# Altium schematic sheet bh_carrier_0_beta.SchDoc
size A2
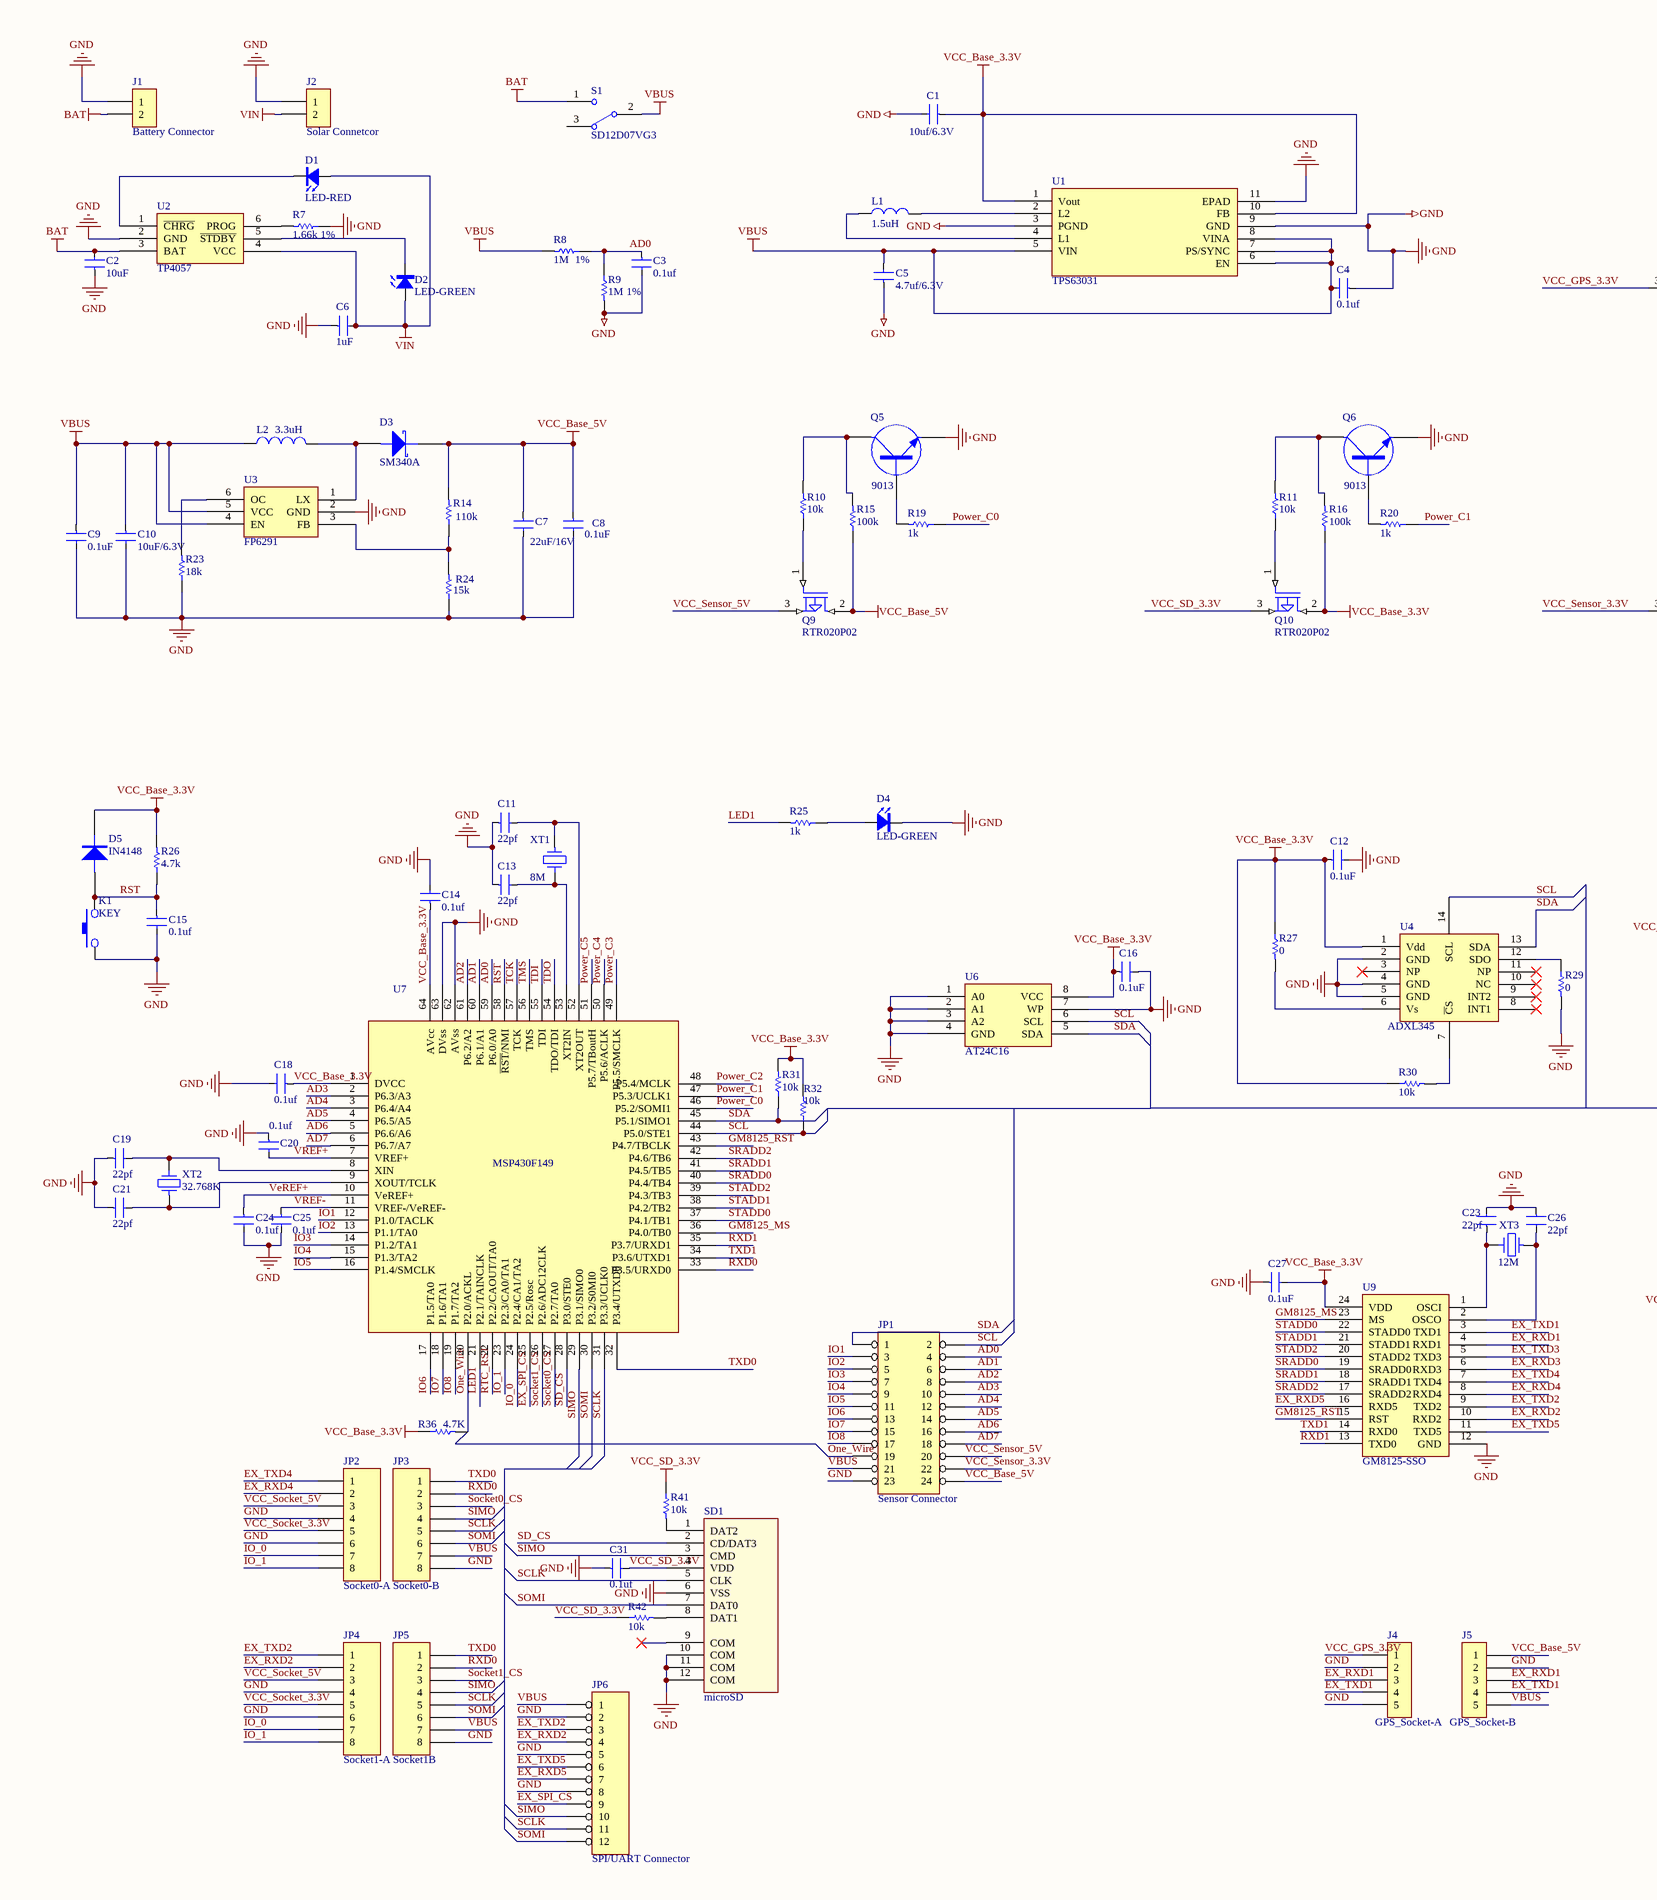
[diagram p0: bh_carrier_0_beta.SchDoc, left]
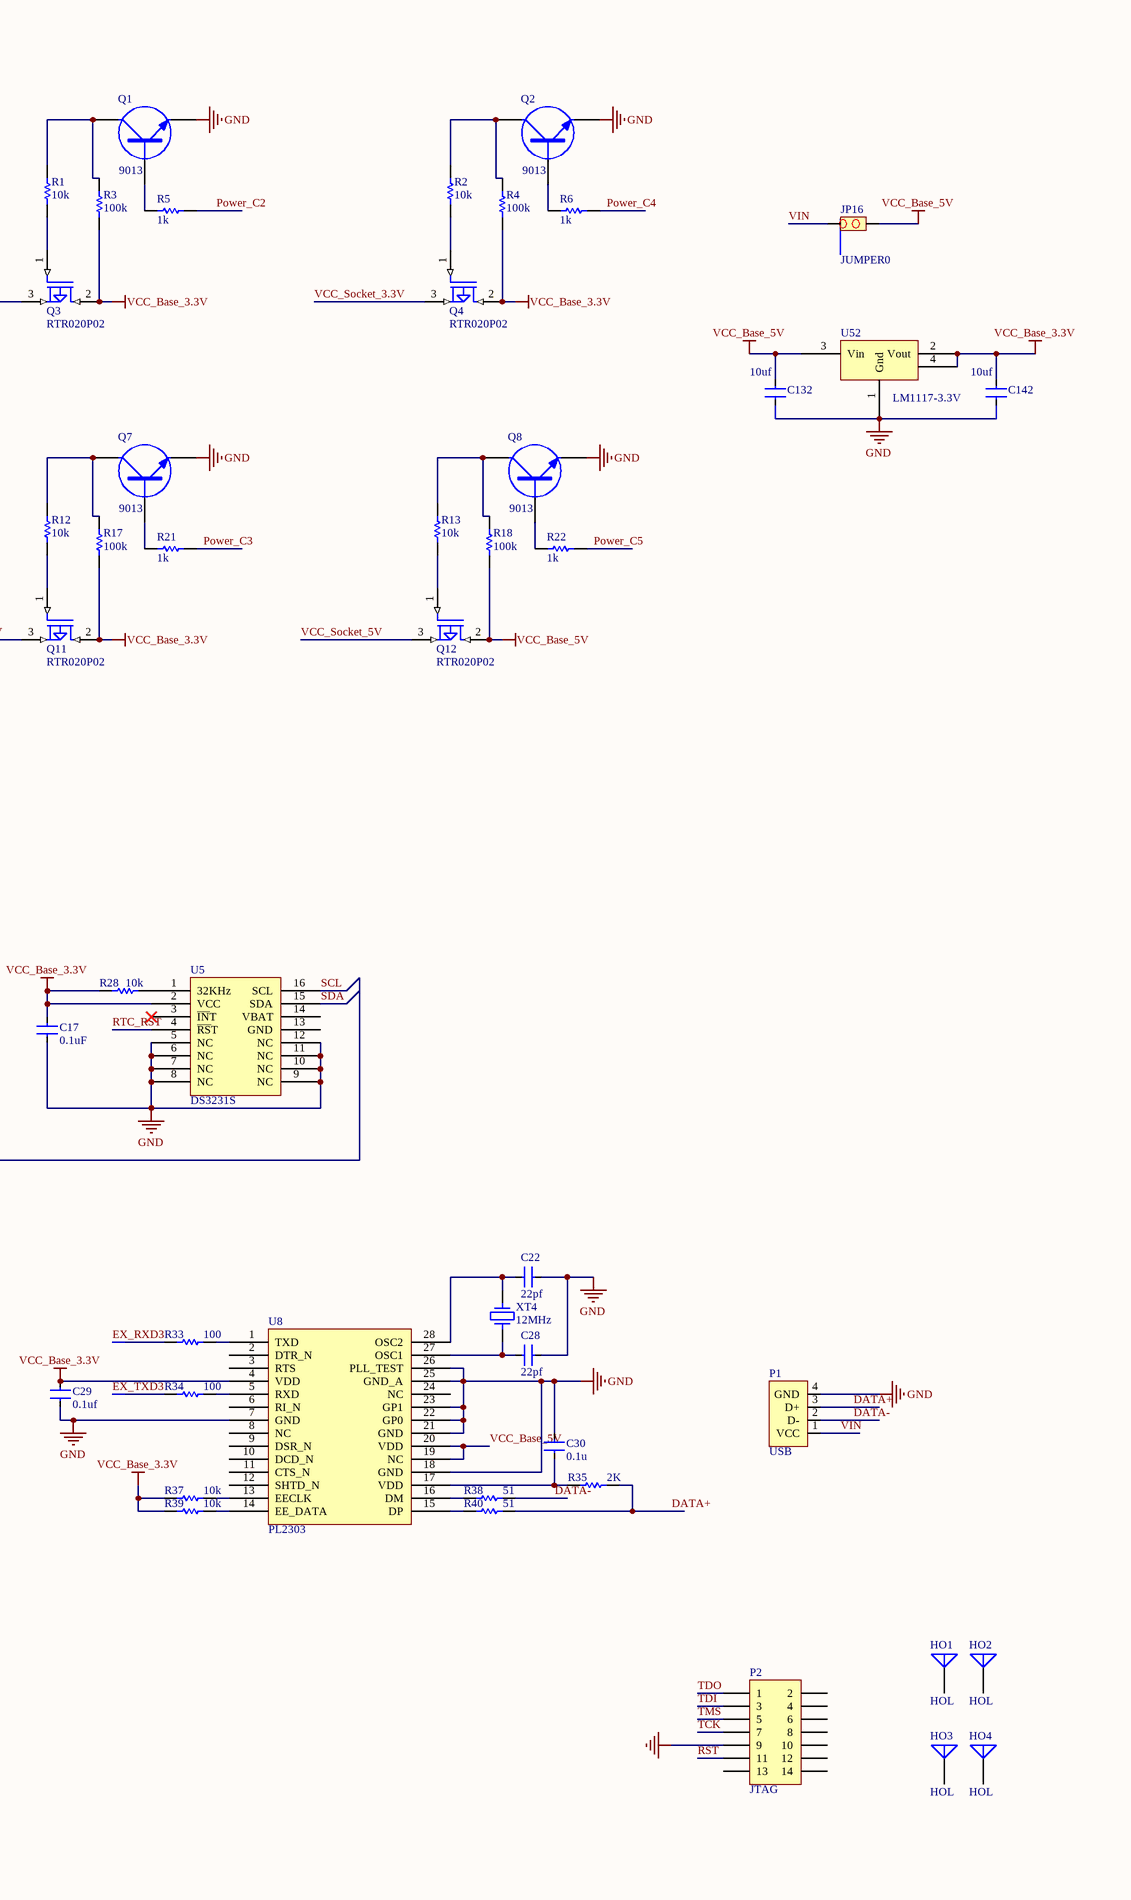
[diagram p1: bh_carrier_0_beta.SchDoc, right]

## Parts
C1  10uf/6.3V  [C0603]
C2  10uF  [C0603]
C3  0.1uf  [C0603]
C4  0.1uf  [C0603]
C5  4.7uf/6.3V  [C0603]
C6  1uF  [C0603]
C7  22uF/16V  [C0603]
C8  0.1uF  [C0603]
C9  0.1uF  [C0603]
C10  10uF/6.3V  [C0603]
C11  22pf  [C0603]
C12  0.1uF  [C0603]
C13  22pf  [C0603]
C14  0.1uf  [C0603]
C15  0.1uf  [C0603]
C16  0.1uF  [C0603]
C17  0.1uF  [C0603]
C18  0.1uf  [C0603]
C19  22pf  [C0603]
C20  0.1uf  [C0603]
C21  22pf  [C0603]
C22  22pf  [C0603]
C23  22pf  [C0603]
C24  0.1uf  [C0603]
C25  0.1uf  [C0603]
C26  22pf  [C0603]
C27  0.1uF  [C0603]
C28  22pf  [C0603]
C29  0.1uf  [C0603]
C30  0.1u  [C0603]
C31  0.1uf  [C0603]
C132  10uf  [C0603]
C142  10uf  [C0603]
D1  LED-RED  [D0805]
D2  LED-GREEN  [D0805]
D3  SM340A  [DO-214]
D4  LED-GREEN  [D0805]
D5  IN4148  [D1206]
HO1  HOL  [HOLE1]
HO2  HOL  [HOLE1]
HO3  HOL  [HOLE1]
HO4  HOL  [HOLE1]
J1  Battery Connector  [SIP1X2X2.0]
J2  Solar Connetcor  [SIP1X2X2.0]
J4  GPS_Socket-A  [SIP1X5X2.54]
J5  GPS_Socket-B  [SIP1X5X2.54]
JP1  Sensor Connector  [SIP2X12X2.54]
JP2  Socket0-A  [SIP1x8x2.54]
JP3  Socket0-B  [SIP1x8x2.54]
JP4  Socket1-A  [SIP1x8x2.0]
JP5  Socket1B  [SIP1x8x2.0]
JP6  SPI/UART Connector  [SIP1x12x2.54]
JP16  JUMPER0  [SIP1X2X2.54]
K1  KEY  [KEY_2Pin]
L1  1.5uH  [LPS3010]
L2  3.3uH  [L1206]
P1  USB  [MicroUSB_four]
P2  JTAG  [SIP2X7X2.54]
Q1  9013  [SOT-23]
Q2  9013  [SOT-23]
Q3  RTR020P02  [TSMT3]
Q4  RTR020P02  [TSMT3]
Q5  9013  [SOT-23]
Q6  9013  [SOT-23]
Q7  9013  [SOT-23]
Q8  9013  [SOT-23]
Q9  RTR020P02  [TSMT3]
Q10  RTR020P02  [TSMT3]
Q11  RTR020P02  [TSMT3]
Q12  RTR020P02  [TSMT3]
R1  10k  [R0603]
R2  10k  [R0603]
R3  100k  [R0603]
R4  100k  [R0603]
R5  1k  [R0603]
R6  1k  [R0603]
R7  1.66k 1%  [R0603]
R8  1M  1%  [R0603]
R9  1M 1%  [R0603]
R10  10k  [R0603]
R11  10k  [R0603]
R12  10k  [R0603]
R13  10k  [R0603]
R14  110k  [R0603]
R15  100k  [R0603]
R16  100k  [R0603]
R17  100k  [R0603]
R18  100k  [R0603]
R19  1k  [R0603]
R20  1k  [R0603]
R21  1k  [R0603]
R22  1k  [R0603]
R23  18k  [R0603]
R24  15k  [R0603]
R25  1k  [R0603]
R26  4.7k  [R0603]
R27  0  [R0603]
R28  10k  [R0603]
R29  0  [R0603]
R30  10k  [R0603]
R31  10k  [R0603]
R32  10k  [R0603]
R33  100  [R0603]
R34  100  [R0603]
R35  2k  [R0603]
R36  4.7K  [R0603]
R37  10k  [R0603]
R38  51  [R0603]
R39  10k  [R0603]
R40  51  [R0603]
R41  10k  [R0603]
R42  10k  [R0603]
S1  SD12D07VG3  [SW-1-2]
SD1  microSD  [TF_CARD]
U1  TPS63031  [QFN-10]
U2  TP4057  [SOT23-6]
U3  FP6291  [SOT23-6]
U4  ADXL345  [LGA-CC-14-1]
U5  DS3231S  [SOP16]
U6  AT24C16  [SO-8]
U7  MSP430F149  [LQFP64_M]
U8  PL2303  [SOP28]
U9  GM8125-SSO  [SOP-24]
U52  LM1117-3.3V  [SOT-223]
XT1  8M  [HC-49S]
XT2  32.768K  [AT308]
XT3  12M  [HC-49S]
XT4  12MHz  [HC-49S]

## Nets
BAT: C2.2 J1.2 S1.1 U2.3(BAT)
GND: C1.2 C2.1 C3.2 C4.1 C5.1 C6.1 C7.2 C8.2 C9.2 C10.2 C11.1 C12.2 C13.1 C14.2 C15.2 C16.2 C17.2 C18.2 C19.1 C20.1 C21.1 C22.2 C23.2 C24.2 C25.2 C26.1 C27.1 C28.2 C29.2 C30.1 C31.1 C132.2 C142.2 D4.K J1.1 J2.1 J4.2 J4.5 J5.2 JP1.23 JP2.4 JP2.6 JP3.8 JP4.4 JP4.6 JP5.8 JP6.2 JP6.5 JP6.8 K1.1 P1.4(GND) P2.9 Q1.2(E) Q2.2(E) Q5.2(E) Q6.2(E) Q7.2(E) Q8.2(E) R7.1 R9.2 R23.1 R24.1 R29.2 SD1.6(VSS) SD1.10(COM) SD1.11(COM) SD1.12(COM) U1.3(PGND) U1.9(GND) U1.11(EPAD) U2.2(GND) U3.2(GND) U4.2(GND) U4.4(GND) U4.5(GND) U5.5(NC) U5.6(NC) U5.7(NC) U5.8(NC) U5.9(NC) U5.10(NC) U5.11(NC) U5.12(NC) U6.1(A0) U6.2(A1) U6.3(A2) U6.4(GND) U6.7(WP) U7.62(AVss) U7.63(DVss) U8.7(GND) U8.18(GND) U8.21(GND) U8.22(GP0) U8.23(GP1) U8.25(GND_A) U8.26(PLL_TEST) U9.12(GND) U52.1(Gnd)
VBUS: C4.2 C5.2 C9.1 C10.1 J5.5 JP1.21 JP3.7 JP5.7 JP6.1 L2.1 R8.2 S1.2 U1.5(VIN) U1.6(EN) U1.7(PS/SYNC) U1.8(VINA) U3.4(EN) U3.5(VCC)
VCC_Base_3.3V: C1.1 C12.1 C14.1 C16.1 C17.1 C18.1 C27.2 C29.1 C142.1 D5.2(K) Q3.2(D) Q4.2(D) Q10.2(D) Q11.2(D) R3.1 R4.1 R16.1 R17.1 R26.2 R27.1 R28.2 R30.1 R31.2 R32.2 R36.1 R37.2 R39.2 U1.1(Vout) U1.10(FB) U4.1(Vdd) U5.2(VCC) U6.8(VCC) U7.1(DVCC) U7.64(AVcc) U8.4(VDD) U9.24(VDD) U52.2(Vout) U52.4
VCC_Base_5V: C7.1 C8.1 C132.1 D3.2(K) J5.1 JP1.24 JP16.2 Q9.2(D) Q12.2(D) R14.2 R15.1 R18.1 U8.19(NC) U8.20(VDD) U52.3(Vin)
VCC_SD_3.3V: C31.2 Q10.3(S) R41.1 R42.1 SD1.4(VDD)
VIN: C6.2 D1.A D2.A J2.2 JP16.1 P1.1(VCC) U2.4(VCC)
AD0: C3.1 JP1.4 R8.1 R9.1 U7.59(P6.0/A0)
AD1: JP1.6 U7.60(P6.1/A1)
AD2: JP1.8 U7.61(P6.2/A2)
AD3: JP1.10 U7.2(P6.3/A3)
AD4: JP1.12 U7.3(P6.4/A4)
AD5: JP1.14 U7.4(P6.5/A5)
AD6: JP1.16 U7.5(P6.6/A6)
AD7: JP1.18 U7.6(P6.7/A7)
DATA+: P1.3(D+) R35.1 R40.1
DATA-: P1.2(D-) R38.1
EX_RXD1: J4.3 J5.3 U9.4(RXD1)
EX_RXD2: JP4.2 JP6.4 U9.10(RXD2)
EX_RXD3: R33.2 U9.6(RXD3)
EX_RXD4: JP2.2 U9.8(RXD4)
EX_RXD5: JP6.7 U9.16(RXD5)
EX_SPI_CS: JP6.9 U7.25(P2.5/Rosc)
EX_TXD1: J4.4 J5.4 U9.3(TXD1)
EX_TXD2: JP4.1 JP6.3 U9.9(TXD2)
EX_TXD3: R34.2 U9.5(TXD3)
EX_TXD4: JP2.1 U9.7(TXD4)
EX_TXD5: JP6.6 U9.11(TXD5)
GM8125_MS: U7.36(P4.0/TB0) U9.23(MS)
GM8125_RST: U7.43(P4.7/TBCLK) U9.15(RST)
IO1: JP1.3 U7.12(P1.0/TACLK)
IO2: JP1.5 U7.13(P1.1/TA0)
IO3: JP1.7 U7.14(P1.2/TA1)
IO4: JP1.9 U7.15(P1.3/TA2)
IO5: JP1.11 U7.16(P1.4/SMCLK)
IO6: JP1.13 U7.17(P1.5/TA0)
IO7: JP1.15 U7.18(P1.6/TA1)
IO8: JP1.17 U7.19(P1.7/TA2)
IO_0: JP2.7 JP4.7 U7.24(P2.4/CA1/TA2)
IO_1: JP2.8 JP4.8 U7.23(P2.3/CA0/TA1)
LED1: R25.2 U7.21(P2.1/TAINCLK)
One_Wire: JP1.19 R36.2 U7.20(P2.0/ACKL)
Power_C0: R19.1 U7.46(P5.2/SOMI1)
Power_C1: R20.1 U7.47(P5.3/UCLK1)
Power_C2: R5.1 U7.48(P5.4/MCLK)
Power_C3: R21.1 U7.49(P5.5/SMCLK)
Power_C4: R6.1 U7.50(P5.6/ACLK)
Power_C5: R22.1 U7.51(P5.7/TBoutH)
RST: C15.1 D5.1(A) K1.2 P2.11 R26.1 U7.58(~{RST}/NMI)
RTC_RST: U5.4(~{RS}T) U7.22(P2.2/CAOUT/TA0)
RXD0: JP3.2 JP5.2 U7.33(P3.5/URXD0)
RXD1: U7.35(P3.7/URXD1) U9.13(TXD0)
SCL: JP1.2 R32.1 U4.14(SCL) U5.16(SCL) U6.6(SCL) U7.44(P5.0/STE1)
SCLK: JP3.5 JP5.5 JP6.11 SD1.5(CLK) U7.31(P3.3/UCLK0)
SD_CS: SD1.2(CD/DAT3) U7.28(P3.0/STE0)
SDA: JP1.1 R31.1 U4.13(SDA) U5.15(SDA) U6.5(SDA) U7.45(P5.1/SIMO1)
SIMO: JP3.4 JP5.4 JP6.10 SD1.3(CMD) U7.29(P3.1/SIMO0)
Socket0_CS: JP3.3 U7.27(P2.7/TA0)
Socket1_CS: JP5.3 U7.26(P2.6/ADC12CLK)
SOMI: JP3.6 JP5.6 JP6.12 SD1.7(DAT0) U7.30(P3.2/S0MI0)
SRADD0: U7.40(P4.4/TB4) U9.19(SRADD0)
SRADD1: U7.41(P4.5/TB5) U9.18(SRADD1)
SRADD2: U7.42(P4.6/TB6) U9.17(SRADD2)
STADD0: U7.37(P4.1/TB1) U9.22(STADD0)
STADD1: U7.38(P4.2/TB2) U9.21(STADD1)
STADD2: U7.39(P4.3/TB3) U9.20(STADD2)
TCK: P2.7 U7.57(TCK)
TDI: P2.3 U7.55(TDI)
TDO: P2.1 U7.54(TDO/TDI)
TMS: P2.5 U7.56(TMS)
TXD0: JP3.1 JP5.1 U7.32(P3.4/UTXD0)
TXD1: U7.34(P3.6/UTXD1) U9.14(RXD0)
VCC_GPS_3.3V: J4.1 Q3.3(S)
VCC_Sensor_3.3V: JP1.22 Q11.3(S)
VCC_Sensor_5V: JP1.20 Q9.3(S)
VCC_Socket_3.3V: JP2.5 JP4.5 Q4.3(S)
VCC_Socket_5V: JP2.3 JP4.3 Q12.3(S)
VeREF+: C24.1 U7.10(VeREF+)
VREF+: C20.2 U7.7(VREF+)
VREF-: C25.1 U7.11(VREF-/VeREF-)
NetC11_2: C11.2 U7.52(XT2OUT) XT1.1
NetC13_2: C13.2 U7.53(XT2IN) XT1.2
NetC19_2: C19.2 U7.8(XIN) XT2.2
NetC21_2: C21.2 U7.9(XOUT/TCLK) XT2.1
NetC22_1: C22.1 U8.28(OSC2) XT4.2
NetC23_1: C23.1 U9.1(OSCI) XT3.2
NetC26_2: C26.2 U9.2(OSCO) XT3.1
NetC28_1: C28.1 U8.27(OSC1) XT4.1
NetC30_2: C30.2 R35.2 U8.17(VDD)
NetD1_K: D1.K U2.1(~{CHRG})
NetD2_K: D2.K U2.5(~{STDBY})
NetD3_1: D3.1(A) L2.2 U3.1(LX)
NetD4_A: D4.A R25.1
NetL1_1: L1.1 U1.2(L2)
NetL1_2: L1.2 U1.4(L1)
NetQ1_1: Q1.1(B) R5.2
NetQ1_3: Q1.3(C) R1.2 R3.2
NetQ2_1: Q2.1(B) R6.2
NetQ2_3: Q2.3(C) R2.2 R4.2
NetQ3_1: Q3.1(G) R1.1
NetQ4_1: Q4.1(G) R2.1
NetQ5_1: Q5.1(B) R19.2
NetQ5_3: Q5.3(C) R10.2 R15.2
NetQ6_1: Q6.1(B) R20.2
NetQ6_3: Q6.3(C) R11.2 R16.2
NetQ7_1: Q7.1(B) R21.2
NetQ7_3: Q7.3(C) R12.2 R17.2
NetQ8_1: Q8.1(B) R22.2
NetQ8_3: Q8.3(C) R13.2 R18.2
NetQ9_1: Q9.1(G) R10.1
NetQ10_1: Q10.1(G) R11.1
NetQ11_1: Q11.1(G) R12.1
NetQ12_1: Q12.1(G) R13.1
NetR7_2: R7.2 U2.6(PROG)
NetR14_1: R14.1 R24.2 U3.3(FB)
NetR23_2: R23.2 U3.6(OC)
NetR27_2: R27.2 U4.6(Vs)
NetR28_1: R28.1 U5.1(32KHz)
NetR29_1: R29.1 U4.12(SDO)
NetR30_2: R30.2 U4.7(~{C}S)
NetR33_1: R33.1 U8.1(TXD)
NetR34_1: R34.1 U8.5(RXD)
NetR37_1: R37.1 U8.13(EECLK)
NetR38_2: R38.2 U8.16(DM)
NetR39_1: R39.1 U8.14(EE_DATA)
NetR40_2: R40.2 U8.15(DP)
NetR41_2: R41.2 SD1.1(DAT2)
NetR42_2: R42.2 SD1.8(DAT1)

Not connected (* = marked no-connect by the designer): HO1 1(A); HO2 1(A); HO3 1(A); HO4 1(A); P2 2 4 6 8 10 12 13 14; S1 3; SD1 9(COM)*; U4 3(NP)* 8(INT1)* 9(INT2)* 10(NC)* 11(NP)*; U5 3(~{IN}T)* 13(GND) 14(VBAT); U8 2(DTR_N) 3(RTS) 6(RI_N) 8(NC) 9(DSR_N) 10(DCD_N) 11(CTS_N) 12(SHTD_N) 24(NC)

## Library data of the parts
C1-C31 C132 C142 = CAP-SMD: SMD-CAP
  C2: Value: 10uF
  C6: Value: 1uF
  C7: Value: 22uF/16V
  C8 C9 C12 C16 C17 C27: Value: 0.1uF
  C10: Value: 10uF/6.3V
  C132 C142: Value: 10uf
D1 D2 D4 = LED
D3 = DIODE SCHOTTKY: Schottky Diode
D5 = DIODE
HO1-HO4 = Antenna: Generic Antenna; Published: 24-Mar-1999; LatestRevisionDate: 17-Jul-2002; LatestRevisionNote: Re-released for DXP Platform.; PackageReference: PIN1; Publisher: Altium Limited
J1 J2 = SIP1X2: Connector
J4 J5 = SIP1X5: Connector
JP1 = SIP2X12
JP2-JP5 = SIP1X8: 8 Pin Header
JP6 = SIP1X12: 12 Pin Header
L1 = L1: LPS3015-152
L2 = INDUCTOR: Value: 3.3uH
P2 = Header 7X2: Header, 7-Pin, Dual row; LatestRevisionDate: 17-Jul-2002; LatestRevisionNote: Re-released for DXP Platform.; Publisher: Altium Limited
Q1 Q2 Q5-Q8 = NPN: NPN Transistor
Q3 Q4 Q9-Q12 = MOSFET P
R1-R42 = RES: Resistor
  R1 R2 R10-R13 R28 R30-R32 R37 R39 R41 R42: Value: 10k
  R3 R4 R15-R18: Value: 100k
  R5 R6 R19-R22 R25: Value: 1k
  R7: Value: 1.66k 1%
  R8: Value: 1M  1%
  R9: Value: 1M 1%
  R14: Value: 110k
  R23: Value: 18k
  R24: Value: 15k
  R26: Value: 4.7k
  R27 R29: Value: 0
  R33 R34: Value: 100
  R35: Value: 2K
  R36: Value: 4.7K
  R38 R40: Value: 51
S1 = SW-SPDT: Published: 24-Mar-1999; LatestRevisionDate: 17-Dec-2003; LatestRevisionNote: Schematic revised, PCB Footprint replaced.; DatasheetDocument: 05-Dec-2000; PackageReference: TL36WW15050; Publisher: Altium Limited; ComponentLink1Description: Manufacturer Link; ComponentLink1URL: http://www.apem.com
U1 = TPS63031_2
U2 = PT4057
U5 = DS3231
U9 = GM8125
U52 = ASM1117-2.5V
XT1-XT4 = XT: 晶振